# EAGLE design uNav44_r1.2 (EAGLE 6.6.0)
Assembly variants: SWITCHING, LINEAR_3V3, LINEAR FULL

## Sheet 1 of 2
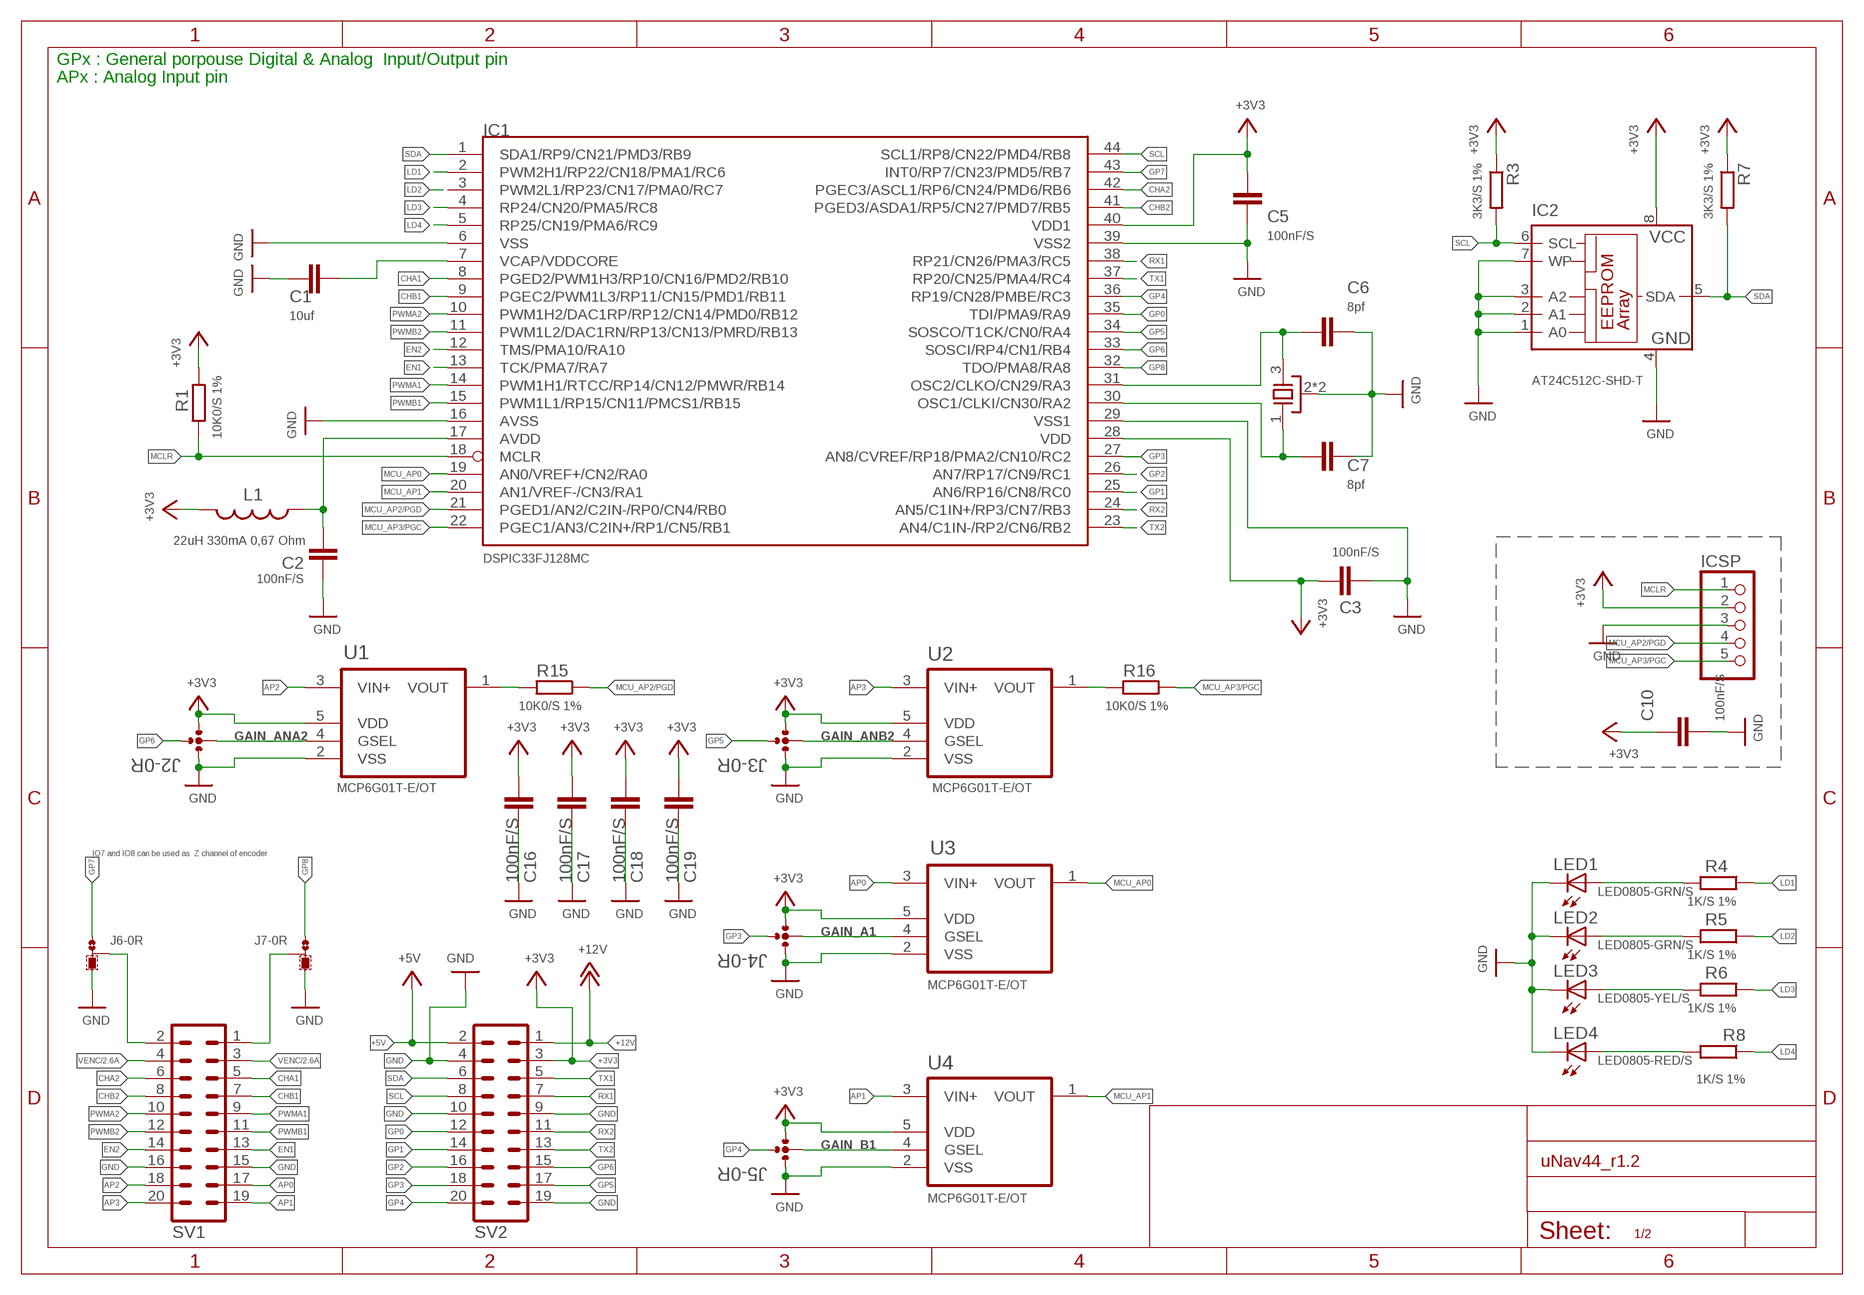
[diagram p0: schematic, sheet 1]

### Parts
C1  10uf  C-EUC1206  [C1206]
C2  100nF/S  C-EUC0603  [C0603]
C3  100nF/S  C-EUC0603  [C0603]
C5  100nF/S  C-EUC0603  [C0603]
C6  8pf  C-EUC0603  [C0603]
C7  8pf  C-EUC0603  [C0603]
C10  100nF/S  C-EUC0603  [C0603]
C16  100nF/S  C-EUC0603  [C0603]
C17  100nF/S  C-EUC0603  [C0603]
C18  100nF/S  C-EUC0603  [C0603]
C19  100nF/S  C-EUC0603  [C0603]
IC1  DSPIC33FJ128MC  DSPIC33FJ128MC804-PT  [TQFP44]
IC2  AT24C512C-SHD-T  24AA01SM  [SO-08M]
ICSP  PINHD-1X05_2.54-S  [1X05-S]
J2  0R-JUMP-4  [C0R-JUMP-4]
J3  0R-JUMP-4  [C0R-JUMP-4]
J4  0R-JUMP-4  [C0R-JUMP-4]
J5  0R-JUMP-4  [C0R-JUMP-4]
J6  0R-JUMPC  [C0R-JMP]
J7  0R-JUMPC  [C0R-JMP]
L1  22uH 330mA 0,67 Ohm  INDUCTOR0805  [0805]
LED1  LED0805-GRN/S  LEDCHIPLED_0805  [CHIPLED_0805]
LED2  LED0805-GRN/S  LEDCHIPLED_0805  [CHIPLED_0805]
LED3  LED0805-YEL/S  LEDCHIPLED_0805  [CHIPLED_0805]
LED4  LED0805-RED/S  LEDCHIPLED_0805  [CHIPLED_0805]
R1  10K0/S 1%  R-EU_R0603  [R0603]
R3  3K3/S 1%  R-EU_R0603  [R0603]
R4  1K/S 1%  R-EU_R0603  [R0603]
R5  1K/S 1%  R-EU_R0603  [R0603]
R6  1K/S 1%  R-EU_R0603  [R0603]
R7  3K3/S 1%  R-EU_R0603  [R0603]
R8  1K/S 1%  R-EU_R0603  [R0603]
R15  10K0/S 1%  R-EU_R0603  [R0603]
R16  10K0/S 1%  R-EU_R0603  [R0603]
SV1  MA10-2  [MA10-2]
SV2  MA10-2  [MA10-2]
U1  MCP6G01T-E/OT  [SOT95P300X145-5N]
U2  MCP6G01T-E/OT  [SOT95P300X145-5N]
U3  MCP6G01T-E/OT  [SOT95P300X145-5N]
U4  MCP6G01T-E/OT  [SOT95P300X145-5N]
XT1  10Mhz 8pf SMD 3,20x2,50  CTS_32X25_SMD  [CTS_32X25]

### Nets
+3V3: C3.1 C5.2 C10.1 C16.1 C17.1 C18.1 C19.1 IC1.28(VDD) IC1.40(VDD1) IC2.8(VCC) ICSP.2 J2.1 J3.1 J4.1 J5.1 L1.2 R1.2 R3.1 R7.1 SV2.3 U1.5(VDD) U2.5(VDD) U3.5(VDD) U4.5(VDD) ; also sheet 2
+5V: SV2.2 ; also sheet 2
+12V: SV2.1 ; also sheet 2
AP0: SV1.17 U3.3(VIN+)
AP1: SV1.19 U4.3(VIN+)
AP2: SV1.18 U1.3(VIN+)
AP3: SV1.20 U2.3(VIN+)
AVDD: C2.2 IC1.17(AVDD) L1.1
CHA1: IC1.8(PGED2/PWM1H3/RP10/CN16/PMD2/RB10) SV1.5
CHA2: IC1.42(PGEC3/ASCL1/RP6/CN24/PMD6/RB6) SV1.6
CHB1: IC1.9(PGEC2/PWM1L3/RP11/CN15/PMD1/RB11) SV1.7
CHB2: IC1.41(PGED3/ASDA1/RP5/CN27/PMD7/RB5) SV1.8
EN1: IC1.13(TCK/PMA7/RA7) SV1.13
EN2: IC1.12(TMS/PMA10/RA10) SV1.14
GAIN_A1: J4.2 U3.4(GSEL)
GAIN_ANA2: J2.2 U1.4(GSEL)
GAIN_ANB2: J3.2 U2.4(GSEL)
GAIN_B1: J5.2 U4.4(GSEL)
GND: C1.2 C2.1 C3.2 C5.1 C6.2 C7.1 C10.2 C16.2 C17.2 C18.2 C19.2 IC1.6(VSS) IC1.16(AVSS) IC1.29(VSS1) IC1.39(VSS2) IC2.1(A0) IC2.2(A1) IC2.3(A2) IC2.4(GND) IC2.7(WP) ICSP.3 J2.3 J3.3 J4.3 J5.3 J6.3 J7.3 LED1.C LED2.C LED3.C LED4.C SV1.15 SV1.16 SV2.4 SV2.9 SV2.10 SV2.19 U1.2(VSS) U2.2(VSS) U3.2(VSS) U4.2(VSS) XT1.2(GND) XT1.4(GND) ; also sheet 2
GP0: IC1.35(TDI/PMA9/RA9) SV2.12
GP1: IC1.25(AN6/RP16/CN8/RC0) SV2.14
GP2: IC1.26(AN7/RP17/CN9/RC1) SV2.16
GP3: IC1.27(AN8/CVREF/RP18/PMA2/CN10/RC2) J4.4 SV2.18
GP4: IC1.36(RP19/CN28/PMBE/RC3) J5.4 SV2.20
GP5: IC1.34(SOSCO/T1CK/CN0/RA4) J3.4 SV2.17
GP6: IC1.33(SOSCI/RP4/CN1/RB4) J2.4 SV2.15
GP7: IC1.43(INT0/RP7/CN23/PMD5/RB7) J6.1
GP8: IC1.32(TDO/PMA8/RA8) J7.1
LD1: IC1.2(PWM2H1/RP22/CN18/PMA1/RC6) R4.1
LD2: IC1.3(PWM2L1/RP23/CN17/PMA0/RC7) R5.1
LD3: IC1.4(RP24/CN20/PMA5/RC8) R6.1
LD4: IC1.5(RP25/CN19/PMA6/RC9) R8.1
MCLR: IC1.18(MCLR) ICSP.1 R1.1
MCU_AP0: IC1.19(AN0/VREF+/CN2/RA0) U3.1(VOUT)
MCU_AP1: IC1.20(AN1/VREF-/CN3/RA1) U4.1(VOUT)
MCU_AP2/PGD: IC1.21(PGED1/AN2/C2IN-/RP0/CN4/RB0) ICSP.4 R15.1
MCU_AP3/PGC: IC1.22(PGEC1/AN3/C2IN+/RP1/CN5/RB1) ICSP.5 R16.1
N$2: C7.2 IC1.30(OSC1/CLKI/CN30/RA2) XT1.1(X1)
N$3: C6.1 IC1.31(OSC2/CLKO/CN29/RA3) XT1.3(X2)
N$10: J6.2 SV1.2
N$12: LED1.A R4.2
N$13: LED2.A R5.2
N$21: R15.2 U1.1(VOUT)
N$22: R16.2 U2.1(VOUT)
N$23: J7.2 SV1.1
PWMA1: IC1.14(PWM1H1/RTCC/RP14/CN12/PMWR/RB14) SV1.9
PWMA2: IC1.10(PWM1H2/DAC1RP/RP12/CN14/PMD0/RB12) SV1.10
PWMB1: IC1.15(PWM1L1/RP15/CN11/PMCS1/RB15) SV1.11
PWMB2: IC1.11(PWM1L2/DAC1RN/RP13/CN13/PMRD/RB13) SV1.12
RX1: IC1.38(RP21/CN26/PMA3/RC5) SV2.7
RX2: IC1.24(AN5/C1IN+/RP3/CN7/RB3) SV2.11
SCL: IC1.44(SCL1/RP8/CN22/PMD4/RB8) IC2.6(SCL) R3.2 SV2.8
SDA: IC1.1(SDA1/RP9/CN21/PMD3/RB9) IC2.5(SDA) R7.2 SV2.6
TX1: IC1.37(RP20/CN25/PMA4/RC4) SV2.5
TX2: IC1.23(AN4/C1IN-/RP2/CN6/RB2) SV2.13
VCAP/VDDCORE: C1.1 IC1.7(VCAP/VDDCORE)
VENC: SV1.3 SV1.4 ; also sheet 2
VENC1-LD3: LED3.A R6.2
VENC2-LD4: LED4.A R8.2

### Notes on the sheet
- GPx : General porpouse Digital & Analog  Input/Output pin
- APx : Analog Input pin
- IO7 and IO8 can be used as  Z channel of encoder

## Sheet 2 of 2
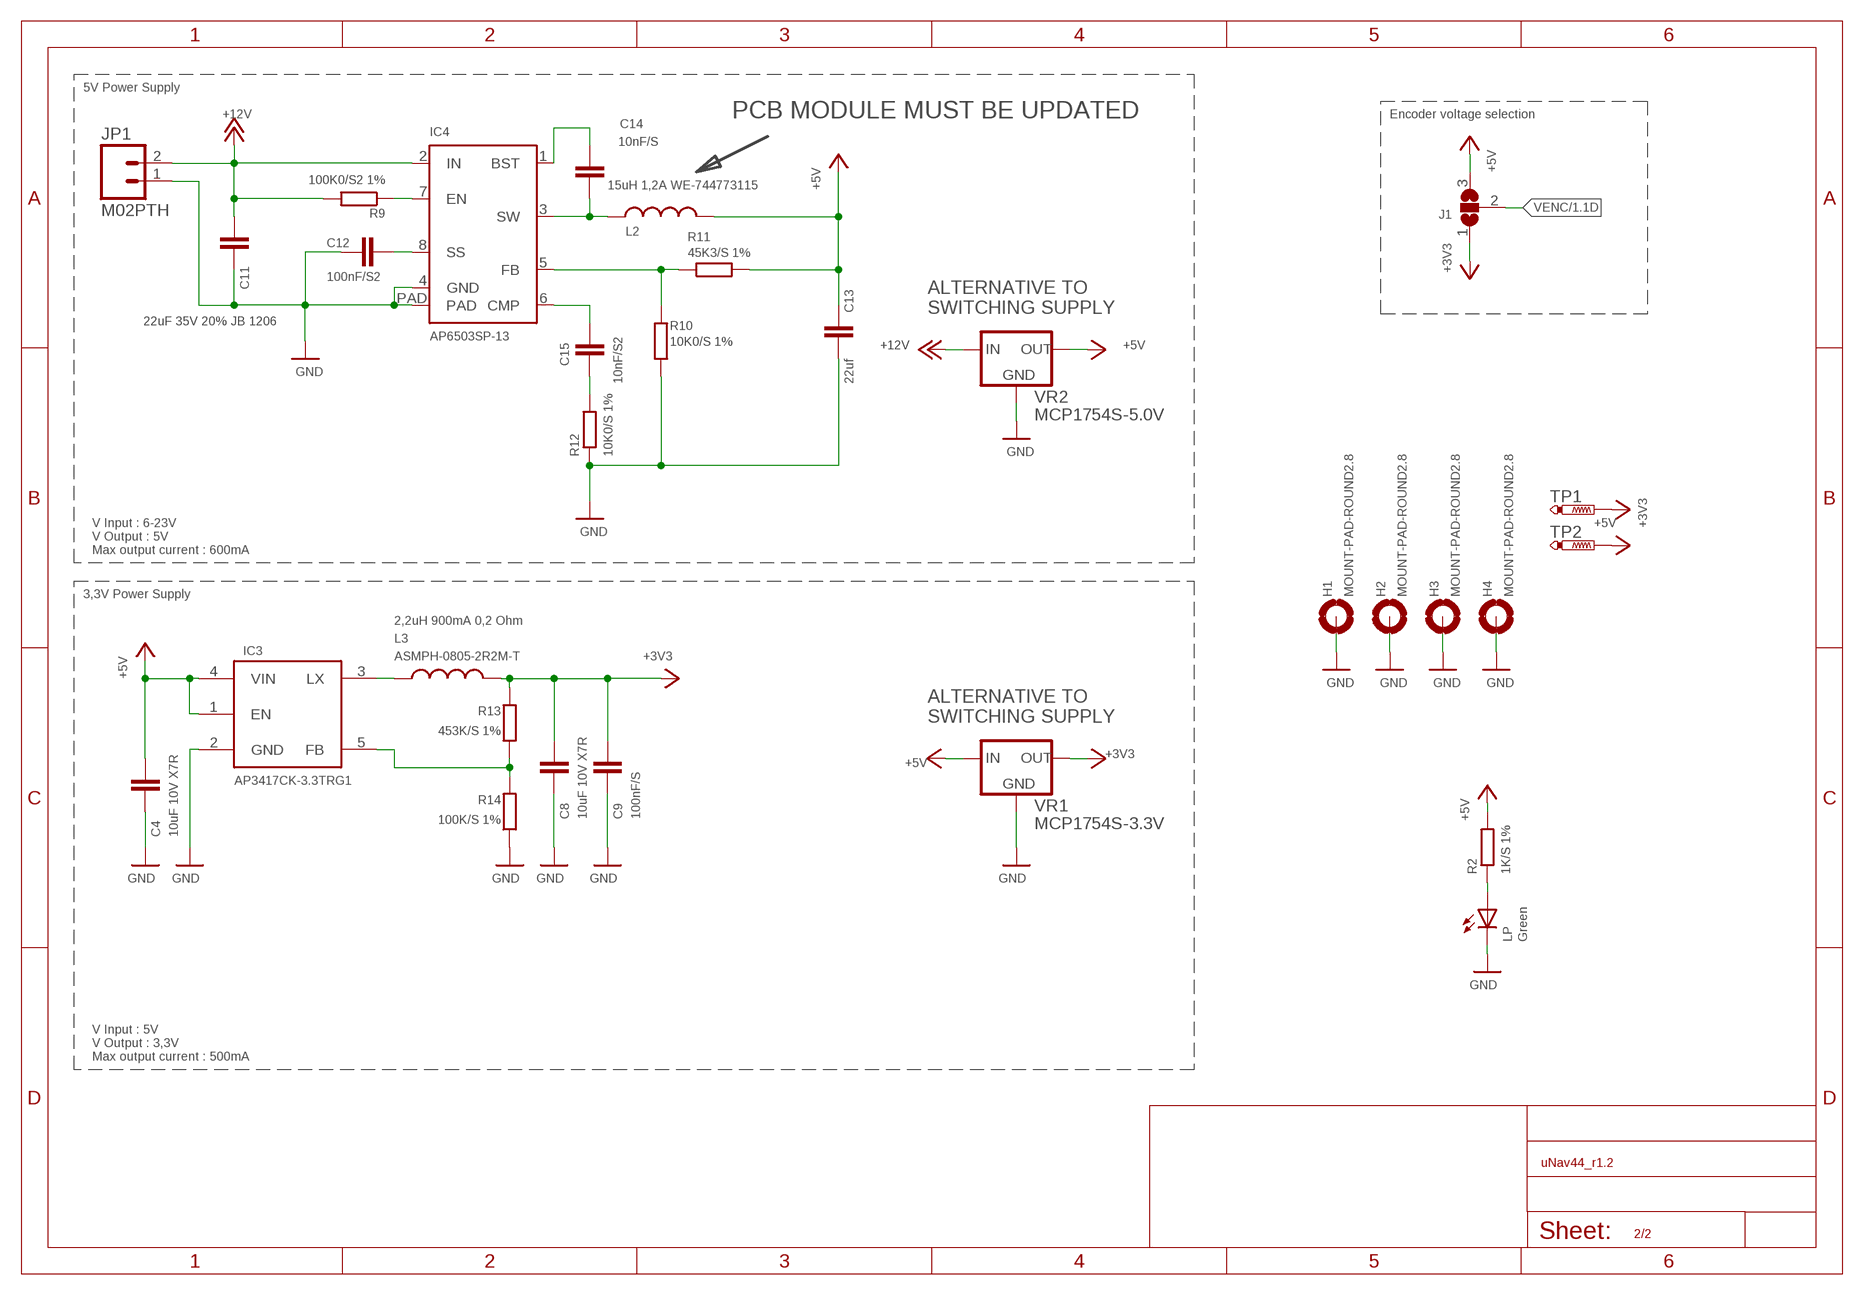
[diagram p1: schematic, sheet 2]

### Parts
C4  10uF 10V X7R  C-EUC0805  [C0805]
C8  10uF 10V X7R  C-EUC0805  [C0805]
C9  100nF/S  C-EUC0603  [C0603]
C11  22uF 35V 20% JB 1206  C-EUC1206  [C1206]
C12  100nF/S2  C-EUC0603  [C0603]  (not fitted in variant LINEAR FULL)
C13  22uf  C-EUC1206  [C1206]
C14  10nF/S  C-EUC0603  [C0603]  (not fitted in variant LINEAR FULL)
C15  10nF/S2  C-EUC0603  [C0603]  (not fitted in variant LINEAR FULL)
H1  MOUNT-PAD-ROUND2.8  [2,8-PAD]
H2  MOUNT-PAD-ROUND2.8  [2,8-PAD]
H3  MOUNT-PAD-ROUND2.8  [2,8-PAD]
H4  MOUNT-PAD-ROUND2.8  [2,8-PAD]
IC3  AP3417CK-3.3TRG1  AP3417CSOT-23-5  [SOT-23-5]  (not fitted in variant LINEAR_3V3)  (not fitted in variant LINEAR FULL)
IC4  AP6503SP-13  AP6503SP-13'SO-8EP'  [SO-8EP]  (not fitted in variant LINEAR FULL)
J1  SJ2W  [SJ_2]
JP1  M02PTH  [1X02]  (not fitted in variant SWITCHING)
L2  15uH 1,2A WE-744773115  INDUCTOR1210  [1210]  (not fitted in variant LINEAR FULL)
L3  ASMPH-0805-2R2M-T  INDUCTOR0805  [0805]  (not fitted in variant LINEAR_3V3)  (not fitted in variant LINEAR FULL)
LP  Green  LEDCHIPLED_0805  [CHIPLED_0805]
R2  1K/S 1%  R-EU_R0603  [R0603]
R9  100K0/S2 1%  R-EU_R0603  [R0603]  (not fitted in variant LINEAR FULL)
R10  10K0/S 1%  R-EU_R0603  [R0603]  (not fitted in variant LINEAR FULL)
R11  45K3/S 1%  R-EU_R0603  [R0603]  (not fitted in variant LINEAR FULL)
R12  10K0/S 1%  R-EU_R0603  [R0603]  (not fitted in variant LINEAR FULL)
R13  453K/S 1%  R-EU_R0603  [R0603]  (not fitted in variant LINEAR_3V3)  (not fitted in variant LINEAR FULL)
R14  100K/S 1%  R-EU_R0603  [R0603]  (not fitted in variant LINEAR_3V3)  (not fitted in variant LINEAR FULL)
TP1  PTR1TP07R  [TP07R]
TP2  PTR1TP07R  [TP07R]
VR1  MCP1754S-3.3V  MCP1754S  [SOT89]  (not fitted in variant SWITCHING)
VR2  MCP1754S-5.0V  MCP1754S  [SOT89]  (not fitted in variant SWITCHING)  (not fitted in variant LINEAR_3V3)  (not fitted in variant LINEAR FULL)

### Nets
+3V3: C8.1 C9.1 J1.1 L3.2 R13.2 TP1.TP VR1.3(OUT) ; also sheet 1
+5V: C4.1 C13.1 IC3.1(EN) IC3.4(VIN) J1.3 L2.2 R2.2 R11.2 TP2.TP VR1.1(IN) VR2.3(OUT) ; also sheet 1
+12V: C11.1 IC4.2(IN) JP1.2 R9.2 VR2.1(IN) ; also sheet 1
GND: C4.2 C8.2 C9.2 C11.2 C12.2 C13.2 H1.B2,8(MOUNT) H2.B2,8(MOUNT) H3.B2,8(MOUNT) H4.B2,8(MOUNT) IC3.2(GND) IC4.4(GND) IC4.PAD JP1.1 LP.C R10.2 R12.1 R14.1 VR1.2(GND) VR1.4(GND) VR2.2(GND) VR2.4(GND) ; also sheet 1
N$1: IC3.3(LX) L3.1
N$4: C14.1 IC4.1(BST)
N$5: LP.A R2.1
N$6: IC4.7(EN) R9.1
N$7: IC3.5(FB) R13.1 R14.2
N$8: C12.1 IC4.8(SS)
N$9: IC4.5(FB) R10.1 R11.1
N$15: C14.2 IC4.3(SW) L2.1
N$16: C15.1 IC4.6(CMP)
N$17: C15.2 R12.2
VENC: J1.2 ; also sheet 1

### Notes on the sheet
- 5V Power Supply
- PCB MODULE MUST BE UPDATED | Encoder voltage selection
- ALTERNATIVE TO
  SWITCHING SUPPLY
- V Input : 6-23V
  V Output : 5V
  Max output current : 600mA
- 3,3V Power Supply
- 2,2uH 900mA 0,2 Ohm
- ALTERNATIVE TO
  SWITCHING SUPPLY
- V Input : 5V
  V Output : 3,3V
  Max output current : 500mA

## Library data of the parts
C1-C19 = rcl:C-EU: CAPACITOR, European symbol
H1-H4 = holes:MOUNT-PAD-ROUND: MOUNTING PAD, round
IC1 = microchip-dspic33fjxxmc:DSPIC33FJ128MC804: dsPIC33FJ32MC302/304, dsPIC33FJ64MCX02/X04, AND dsPIC33FJ128MCX02/X04 High-Performance, 16-bit Digital Signal Controllers Package:44 Pin TQFP Operating Range: * Up to 40 MIPS operation (at 3.0V -3.6V): - Industrial temperature range (-40°C to +85°C) - Extended temperature range (-40°C to +125°C) High-Performance DSC CPU: * Modified Harvard architecture * C compiler optimized instruction set * 16-bit wide data path * 24-bit wide instructions * Linear program memory addressing up to 4M instruction words * Linear data memory addressing up to 64 Kbytes * 83 base instructions: mostly 1 word/1 cycle * Two 40-bit accumulators with rounding and saturation options * Flexible and powerful addressing modes: - Indirect - Modulo - Bit-Reversed * Software stack * 16 x 16 fractional/integer multiply operations * 32/16 and 16/16 divide operations * Single-cycle multiply and accumulate: - Accumulator write back for DSP operations - Dual data fetch * Up to ±16-bit shifts for up to 40-bit data Direct Memory Access (DMA): * 8-channel hardware DMA * Up to 2 Kbytes dual ported DMA buffer area (DMA RAM) to store data transferred via DMA: - Allows data transfer between RAM and a peripheral while CPU is executing code (no cycle stealing) * Most peripherals support DMA Timers/Capture/Compare/PWM: * Timer/Counters, up to five 16-bit timers: - Can pair up to make two 32-bit timers - One timer runs as a Real-Time Clock with an external 32.768 kHz oscillator - Programmable prescaler * Input Capture (up to four channels): - Capture on up, down or both edges - 16-bit capture input functions - 4-deep FIFO on each capture * Output Compare (up to four channels): - Single or Dual 16-bit Compare mode - 16-bit Glitchless PWM mode * Hardware Real-Time Clock/Calendar (RTCC): - Provides clock, calendar, and alarm functions Interrupt Controller: * 5-cycle latency * Up to 53 available interrupt sources * Up to three external interrupts * Seven programmable priority levels * Five processor exceptions Digital I/O: * Peripheral pin Select functionality * Up to 35 programmable digital I/O pins * Wake-up/Interrupt-on-Change for up to 31 pins * Output pins can drive from 3.0V to 3.6V * Up to 5V output with open drain configuration * All digital input pins are 5V tolerant * 4 mA sink on all I/O pins On-Chip Flash and SRAM: * Flash program memory (up to 128 Kbytes) * Data SRAM (up to 16 Kbytes) * Boot, Secure, and General Security for program Flash System Management: * Flexible clock options: - External, crystal, resonator, internal RC - Fully integrated Phase-Locked Loop (PLL) - Extremely low jitter PLL * Power-up Timer * Oscillator Start-up Timer/Stabilizer * Watchdog Timer with its own RC oscillator * Fail-Safe Clock Monitor * Reset by multiple sources Power Management: * On-chip 2.5V voltage regulator * Switch between clock sources in real time * Idle, Sleep, and Doze modes with fast wake-up Analog-to-Digital Converters (ADCs): * 10-bit, 1.1 Msps or 12-bit, 500 Ksps conversion: - Two and four simultaneous samples (10-bit ADC) - Up to nine input channels with auto-scanning - Conversion start can be manual or synchronized with one of four trigger sources - Conversion possible in Sleep mode - ±2 LSb max integral nonlinearity - ±1 LSb max differential nonlinearity Audio Digital-to-Analog Converter (DAC): - 16-bit Dual Channel DAC module - 100 Ksps maximum sampling rate - Second-Order Digital Delta-Sigma Modulator Comparator Module: * Two analog comparators with programmable input/output configuration CMOS Flash Technology: * Low-power, high-speed Flash technology * Fully static design * 3.3V (±10%) operating voltage * Industrial and Extended temperature * Low power consumption Motor Control Peripherals: * 6-channel 16-bit Motor Control PWM: - Three duty cycle generators - Independent or Complementary mode - Programmable dead-time and output polarity - Edge-aligned or center-aligned - Manual output override control - One Fault input - Trigger for ADC conversions - PWM frequency for 16-bit resolution (@ 40 MIPS) = 1220 Hz for Edge-Aligned mode, 610 Hz for Center-Aligned mode - PWM frequency for 11-bit resolution (@ 40 MIPS) = 39.1 kHz for Edge-Aligned mode, 19.55 kHz for Center-Aligned mode * 2-channel 16-bit Motor Control PWM: - One duty cycle generator - Independent or Complementary mode - Programmable dead time and output polarity - Edge-aligned or center-aligned - Manual output override control - One Fault input - Trigger for ADC conversions - PWM frequency for 16-bit resolution (@ 40 MIPS) = 1220 Hz for Edge-Aligned mode, 610 Hz for Center-Aligned mode - PWM frequency for 11-bit resolution (@ 40 MIPS) = 39.1 kHz for Edge-Aligned mode, 19.55 kHz for Center-Aligned mode * 2-Quadrature Encoder Interface module: - Phase A, Phase B, and index pulse input - 16-bit up/down position counter - Count direction status - Position Measurement (x2 and x4) mode - Programmable digital noise filters on inputs - Alternate 16-bit Timer/Counter mode - Interrupt on position counter rollover/underflow
IC2 = microchip:24*: Serial EEPROM I2C
IC3 = OfficineRobotiche:AP3417C
IC4 = OfficineRobotiche:AP6503SP-13: 340kHz 23V 3A SYNCHRONOUS DC/DC BUCK CONVERTER
ICSP = pinhead-2:PINHD-1X05: PIN HEADER
J1 = jumper:SJ2W: SMD solder JUMPER
J2-J5 = OfficineRobotiche:0R-JUMP-4
J6 J7 = jump-0r-smd:0R-JUMP: SMD 0R 0805 Jumper
JP1 = SparkFun-Connectors:M02: Standard 2-pin 0.1" header. Use with - straight break away headers ( PRT-00116) - right angle break away headers (PRT-00553) - swiss pins (PRT-00743) - machine pins (PRT-00117) - female headers (PRT-00115) Molex polarized connector foot print use with: PRT-08233 with associated crimp pins and housings. 2.54_SCREWTERM for use with PRT-10571. 3.5mm Screw Terminal footprints for PRT-08084 5mm Screw Terminal footprints for use with PRT-08433
L1-L3 = SparkFun-Passives:INDUCTOR: Inductors Basic Inductor/Choke - 0603 and 1206. Footprints are not proven and vary greatly between part numbers. SRN6045- 33uH, 20% 1.4A SDR0403-560KL - 56uH, 10%, 500mA RMS/740mA peak
LED1-LED4 LP = led:LED: LED OSRAM: - CHIPLED LG R971, LG N971, LY N971, LG Q971, LY Q971, LO R971, LY R971 LH N974, LH R974 LS Q976, LO Q976, LY Q976 LO Q996 - Hyper CHIPLED LW Q18S LB Q993, LB Q99A, LB R99A - SideLED LS A670, LO A670, LY A670, LG A670, LP A670 LB A673, LV A673, LT A673, LW A673 LH A674 LY A675 LS A676, LA A676, LO A676, LY A676, LW A676 LS A679, LY A679, LG A679 - Hyper Micro SIDELED® LS Y876, LA Y876, LO Y876, LY Y876 LT Y87S - SmartLED LW L88C, LW L88S LB L89C, LB L89S, LG L890 LS L89K, LO L89K, LY L89K LS L896, LA L896, LO L896, LY L896 - TOPLED LS T670, LO T670, LY T670, LG T670, LP T670 LSG T670, LSP T670, LSY T670, LOP T670, LYG T670 LG T671, LOG T671, LSG T671 LB T673, LV T673, LT T673, LW T673 LH T674 LS T676, LA T676, LO T676, LY T676, LB T676, LH T676, LSB T676, LW T676 LB T67C, LV T67C, LT T67C, LS T67K, LO T67K, LY T67K, LW E67C LS E67B, LA E67B, LO E67B, LY E67B, LB E67C, LV E67C, LT E67C LW T67C LS T679, LY T679, LG T679 LS T770, LO T770, LY T770, LG T770, LP T770 LB T773, LV T773, LT T773, LW T773 LH T774 LS E675, LA E675, LY E675, LS T675 LS T776, LA T776, LO T776, LY T776, LB T776 LHGB T686 LT T68C, LB T68C - Hyper Mini TOPLED® LB M676 - Mini TOPLED Santana® LG M470 LS M47K, LO M47K, LY M47K Source: http://www.osram.convergy.de LUXEON: - LUMILED® LXK2-PW12-R00, LXK2-PW12-S00, LXK2-PW14-U00, LXK2-PW14-V00 LXK2-PM12-R00, LXK2-PM12-S00, LXK2-PM14-U00 LXK2-PE12-Q00, LXK2-PE12-R00, LXK2-PE12-S00, LXK2-PE14-T00, LXK2-PE14-U00 LXK2-PB12-K00, LXK2-PB12-L00, LXK2-PB12-M00, LXK2-PB14-N00, LXK2-PB14-P00, LXK2-PB14-Q00 LXK2-PR12-L00, LXK2-PR12-M00, LXK2-PR14-Q00, LXK2-PR14-R00 LXK2-PD12-Q00, LXK2-PD12-R00, LXK2-PD12-S00 LXK2-PH12-R00, LXK2-PH12-S00 LXK2-PL12-P00, LXK2-PL12-Q00, LXK2-PL12-R00 Source: www.luxeon.com KINGBRIGHT: KA-3528ASYC Source: www.kingbright.com
R1-R16 = rcl:R-EU_: RESISTOR, European symbol
SV1 SV2 = OfficineRobotiche:MA10-2: PIN HEADER; OC_FARNELL: unknown; OC_NEWARK: unknown
TP1 TP2 = testpad:PTR1: TEST PIN
U1-U4 = OfficineRobotiche:MCP6G01T-E/OT: AMP, SELECT GAIN SINGLE 1 MHZ; MPN: MCP6G01T-E/OT; OC_FARNELL: 1332148; OC_NEWARK: 34M7463; PACKAGE: SOT23-5; SUPPLIER: Microchip
VR1 VR2 = Personale:MCP1754S
XT1 = OfficineRobotiche:CTS_32X25_SMD: http://www.txccrystal.com/images/pdf/7v.pdf http://www.digikey.it/product-detail/it/7V-10.000MAAV-T/887-1791-1-ND/3586039

## Net classes
0 default: width 0.254 mm, drill 0.305 mm, clearance 0.203 mm
1 power: width 0.254 mm, drill 0.305 mm, clearance 0.203 mm

## Board
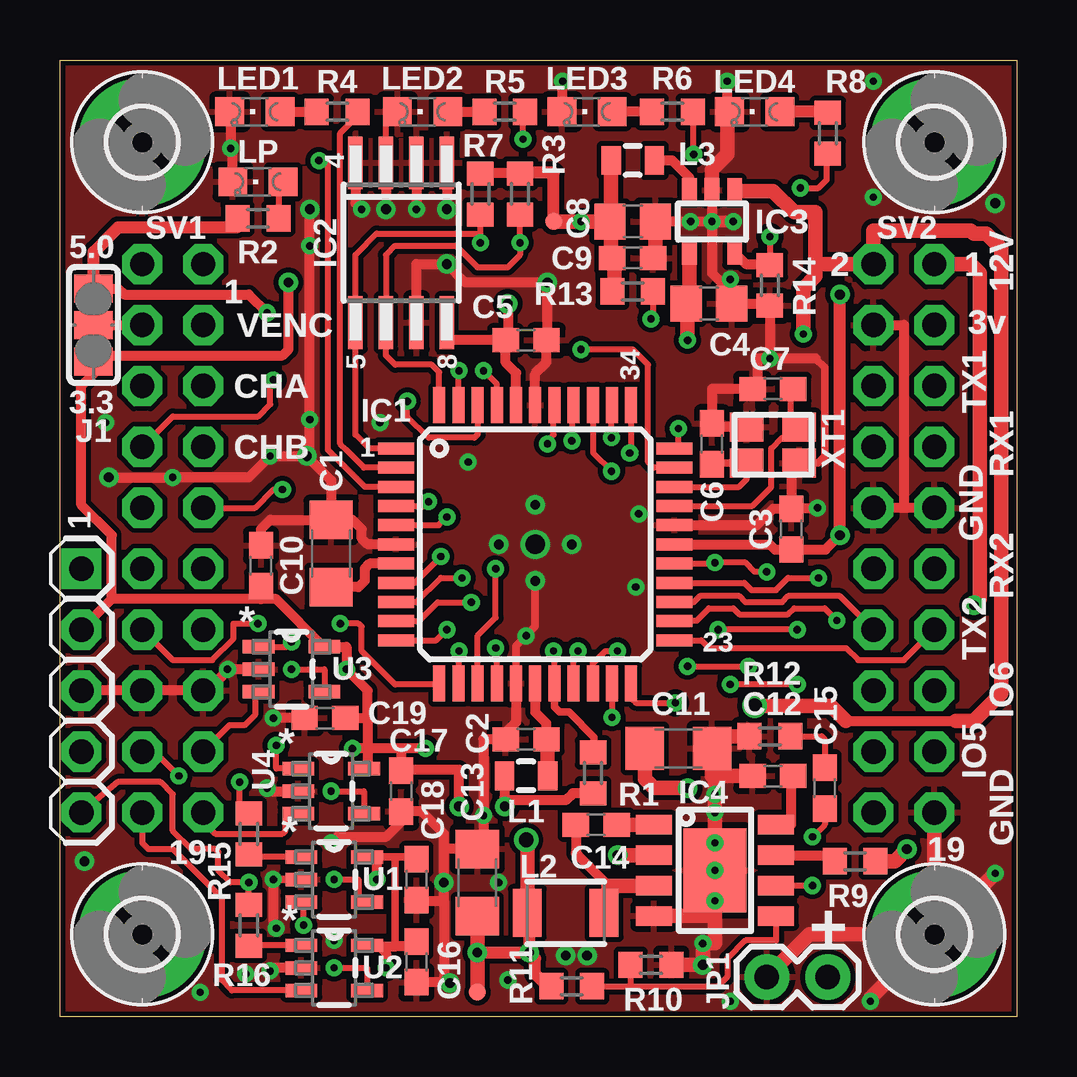
[diagram p2: board, top side]
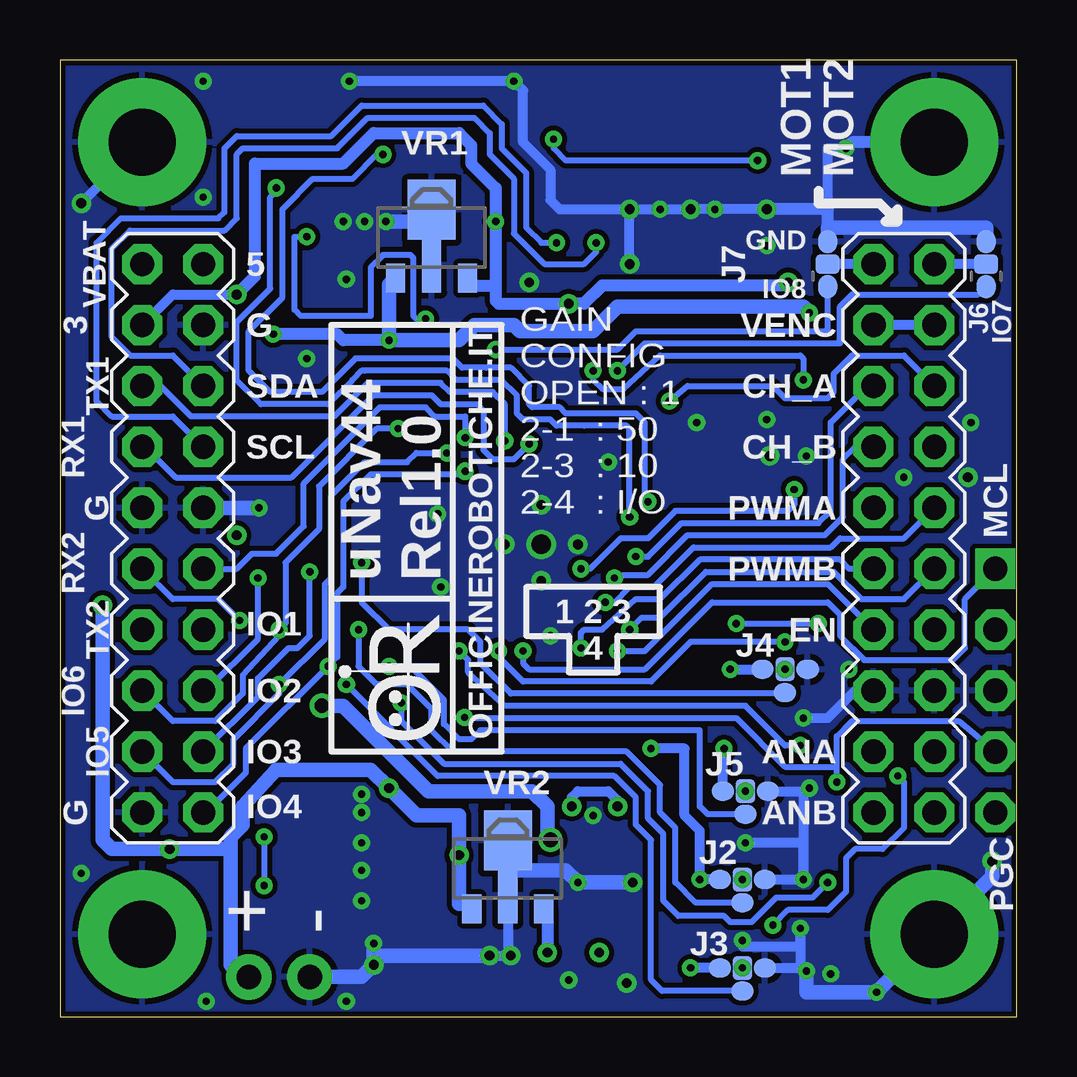
[diagram p3: board, bottom side, seen from below]

Size 39.88 x 39.88 mm. Coordinates in mm from the lower left corner, seen from the top.
Outline: 39.88,0 0,0 0,39.88 39.88,39.88 39.88,0
Copper layers (1*16): Top 0.035mm / dielectric 1.5mm / Bottom 0.035mm
Design rules "uNav44 *": minimum track width 8mil, minimum drill 12mil, track to track 8mil, track to pad 8mil, pad to pad 8mil, via to via 8mil, smd to smd 8mil, copper to edge 8mil, drill to drill 8mil, minimum pad ring 13mil, minimum via ring 8mil, stop-mask expansion 4mil, vias tented up to drill 24mil, thermal gap 10mil

### Footprints (pad centres in the part's own frame; a part is rotated, then mirrored left to right if it is on the bottom)
C1206 = smd 1.6 x 1.8: 1 -1.4,0; 2 1.4,0
C0603 = smd 1.1 x 1: 1 -0.85,0; 2 0.85,0
C0805 = smd 1.3 x 1.5: 1 -0.95,0; 2 0.95,0
2,8-PAD = drill 2.8 pad 5.334: B2,8 0,0
TQFP44 = smd 1.5 x 0.5: 1 -5.8,4; 2 -5.8,3.2; 3 -5.8,2.4; 4 -5.8,1.6; 5 -5.8,0.8; 6 -5.8,0; 7 -5.8,-0.8; 8 -5.8,-1.6; 9 -5.8,-2.4; 10 -5.8,-3.2; 11 -5.8,-4; 23 5.8,-4; 24 5.8,-3.2; 25 5.8,-2.4; 26 5.8,-1.6; 27 5.8,-0.8; 28 5.8,0; 29 5.8,0.8; 30 5.8,1.6; 31 5.8,2.4; 32 5.8,3.2; 33 5.8,4 | smd 0.5 x 1.5: 12 -4,-5.8; 13 -3.2,-5.8; 14 -2.4,-5.8; 15 -1.6,-5.8; 16 -0.8,-5.8; 17 0,-5.8; 18 0.8,-5.8; 19 1.6,-5.8; 20 2.4,-5.8; 21 3.2,-5.8; 22 4,-5.8; 34 4,5.8; 35 3.2,5.8; 36 2.4,5.8; 37 1.6,5.8; 38 0.8,5.8; 39 0,5.8; 40 -0.8,5.8; 41 -1.6,5.8; 42 -2.4,5.8; 43 -3.2,5.8; 44 -4,5.8
SO-08M = smd 0.6 x 2.2: 1 -1.905,-3.33; 2 -0.635,-3.33; 3 0.635,-3.33; 4 1.905,-3.33; 5 1.905,3.33; 6 0.635,3.33; 7 -0.635,3.33; 8 -1.905,3.33
SOT-23-5 = smd 0.61 x 0.991: 1 -0.94,-1.308; 2 0,-1.308; 3 0.94,-1.308; 4 0.94,1.308; 5 -0.94,1.308
SO-8EP = smd 0.802 x 1.505: 1 -1.905,-2.54; 2 -0.635,-2.54; 3 0.635,-2.54; 4 1.905,-2.54; 5 1.905,2.54; 6 0.635,2.54; 7 -0.635,2.54; 8 -1.905,2.54 | smd 3.501 x 2.613: PAD 0,0
1X05-S = drill 1.016 square: 1 -5.08,0 | drill 1.016 octagon: 2 -2.54,0; 3 0,0; 4 2.54,0; 5 5.08,0
SJ_2 = smd 1.168 x 1.6: 1 -1.524,0; 2 0,0; 3 1.524,0
C0R-JUMP-4 = smd 0.8 x 0.95: 1 0,0.94; 3 0,-0.94; 4 -0.965,0 | smd 1 x 0.8: 2 0,0
C0R-JMP = smd 0.8 x 1: 1 0,0.938; 3 0,-0.938 | smd 1 x 0.8: 2 0,0
1X02 = drill 1.016 pad 1.88: 1 0,0; 2 2.54,0
0805 = smd 0.8 x 1.2: 1 -0.9,0; 2 0.9,0
1210 = smd 1.2 x 2: 1 -1.6,0; 2 1.6,0
CHIPLED_0805 = smd 1.2 x 1.2: A 0,-1.05; C 0,1.05
R0603 = smd 1 x 1.1: 1 -0.85,0; 2 0.85,0
MA10-2 = drill 1.016 octagon: 1 -11.43,-1.27; 2 -11.43,1.27; 3 -8.89,-1.27; 4 -8.89,1.27; 5 -6.35,-1.27; 6 -6.35,1.27; 7 -3.81,-1.27; 8 -3.81,1.27; 9 -1.27,-1.27; 10 -1.27,1.27; 11 1.27,-1.27; 12 1.27,1.27; 13 3.81,-1.27; 14 3.81,1.27; 15 6.35,-1.27; 16 6.35,1.27; 17 8.89,-1.27; 18 8.89,1.27; 19 11.43,-1.27; 20 11.43,1.27
TP07R = smd 0.7 x 0.7: TP 0,0
SOT95P300X145-5N = smd 1.321 x 0.559: 1 -1.372,0.94; 2 -1.372,0; 3 -1.372,-0.94; 4 1.372,-0.94; 5 1.372,0.94
SOT89 = smd 0.8 x 1.2: 1 -1.5,-1.6; 3 1.5,-1.6 | smd 0.8 x 2.3: 2 0,-1.05 | smd 2 x 2.5: 4 0,1.25
CTS_32X25 = smd 1.4 x 1.2: 1 -1.1,-0.7; 2 1.1,-0.7; 3 1.1,0.8; 4 -1.1,0.8

### Placement (x,y rotation side)
C1  11.3,19.3 90 top
C2  19.43,11.56 0 top
C3  30.48,20.32 90 top
C4  27.05,29.72 0 top
C5  19.43,28.19 180 top
C6  27.18,23.88 90 top
C7  29.72,26.16 0 top
C8  23.88,33.15 0 top
C9  23.88,31.62 0 top
C10  8.38,18.8 90 top
C11  25.78,11.18 0 top
C12  29.72,10.03 180 top
C13  17.4,5.59 90 top
C14  22.35,8 180 top
C15  31.88,9.53 90 top
C16  14.86,2.29 270 top
C17  14.22,9.4 270 top
C18  14.86,5.71 270 top
C19  11.05,12.45 180 top
H1  3.43,3.43 0 top
H2  36.45,3.43 0 top
H3  36.45,36.45 0 top
H4  3.43,36.45 0 top
IC1  19.81,19.68 0 top
IC2  14.22,32.26 180 top
IC3  27.18,33.15 180 top
IC4  27.3,6.1 270 top
ICSP  0.89,13.59 270 top
J1  1.4,28.83 90 top
J2  11.43,5.71 90 bottom
J3  11.43,2.03 90 bottom
J4  9.65,14.48 90 bottom
J5  11.3,9.4 90 bottom
J6  1.27,31.37 180 bottom
J7  7.87,31.37 180 bottom
JP1  29.46,1.65 0 top
L1  19.43,10.03 180 top
L2  21.08,4.32 180 top
L3  23.88,35.69 180 top
LED1  8.13,37.72 90 top
LED2  15.11,37.72 90 top
LED3  21.97,37.72 90 top
LED4  28.96,37.72 90 top
LP  8.25,34.8 90 top
R1  22.22,10.16 270 top
R2  8.25,33.27 180 top
R3  19.18,34.29 270 top
R4  11.56,37.72 180 top
R5  18.54,37.72 180 top
R6  25.53,37.72 180 top
R7  17.53,34.29 270 top
R8  32,36.83 90 top
R9  33.15,6.48 0 top
R10  24.64,2.16 0 top
R11  21.34,1.27 180 top
R12  29.59,11.68 0 top
R13  23.88,30.23 180 top
R14  29.59,30.48 90 top
R15  7.87,7.62 270 top
R16  7.87,3.81 270 top
SV1  4.7,19.94 270 bottom
SV2  35.18,19.94 270 bottom
TP1  20.57,33.15 0 top
TP2  17.4,1.02 0 top
U1  11.43,5.71 0 top
U2  11.43,2.03 0 top
U3  9.65,14.48 0 top
U4  11.3,9.4 0 top
VR1  24.38,32.38 0 bottom
VR2  21.21,6.1 0 bottom
XT1  29.72,23.88 180 top

### Tracks (layer width: path | path; a pad name or v marks a point on that pad's centre or on a via)
+3V3  (via drill 0.3, 0.41)
  Top 0.254: R7.1 17.56,35.18 | U2.5 12.89,2.88 12.95,2.92 | 14.86,2.92 C16.1
  Top 0.305: C18.1 14.9,6.65 13.97,6.65 | 13.97,6.65 U1.5 | 13.97,2.92 13.97,6.65
  Top 0.406: IC1.40 19.01,26.83 18.58,27.27 C5.2 | IC1.28 29.59,19.68 29.81,19.47 C3.1 31.92,19.47 v32.51,20.07 | C5.2 16.13,28.19 IC2.8 | R7.1 17.4,35.18 17.56,35.18 19.05,35.18 R3.1 | v18.67,29.72 18.67,28.19 C5.2 | L3.2 22.98,33.15 C8.1 | U2.5 13.28,2.97 13.59,2.67 v13.59,2.03 | U4.5 12.83,10.34 12.83,11.18 | 12.83,11.18 v12.19,11.18 | U1.5 13.21,6.65 v13.21,5.71 13.21,5.64 | 8.38,17.4 9.02,17.4 11,15.42 U3.5 11.94,15.42 v11.94,14.48 12.83,13.59 12.83,12.45 | R1.2 21.38,9.31 21.08,9.02 18.54,9.02 v18.54,8.76 18.53,9.13 L1.2 18.54,10.03 L1.2 | v16.64,8.76 16.64,10.29 14.26,10.29 C17.1 14.22,11.18 v15.24,11.18 12.83,11.18 | C19.1 12.83,12.45 | 12.83,12.45 12.83,11.18 | C10.1 8.38,17.4 | v9.53,30.61 9.53,27.81 9.27,27.56 1.52,27.56 1.4,27.43 J1.1 1.4,26.8 0.89,26.29 0.89,21.34 2.16,20.07 2.16,17.4 | 8.38,17.4 2.16,17.4 | 2.16,17.4 ICSP.2 | 14.86,2.92 13.97,2.92 12.95,2.92
  Top 0.508: TP1.TP 20.57,35.18 19.05,35.18 | 22.99,33.15 v21.72,33.15 | v32.51,20.07 v32.51,30.1
  Top 0.61: TP1.TP v21.72,33.15 C8.1 | R13.2 23.11,30.31 23.11,31.5 23.03,31.58 C9.1 22.98,31.67 22.98,33.15 | L3.2 22.98,33.16 22.99,33.15
  Bottom 0.406: SV2.3 35.18,30.1 v32.51,30.1 | v11.94,14.48 J4.1 | v18.54,8.76 18.54,9.14 18.29,9.4 17.02,9.4 16.64,9.02 v16.64,8.76 | J5.1 12.24,10.92 v12.19,11.18 | J2.1 v13.21,5.71 13.21,7.75 13.84,8.38 13.84,11.18 v15.24,11.18 | J3.1 v13.59,2.03
  Bottom 0.508: 21.72,30.48 v21.72,33.15 21.72,34.54 22.73,35.56 22.73,36.32 23.24,36.83 26.8,36.83 28.07,35.56 31.75,35.56 31.75,30.86 v32.51,30.1 | 21.72,30.48 21.72,29.84 21.59,29.72 v18.67,29.72 18.03,29.72 17.27,30.48 9.65,30.48 v9.53,30.61 | VR1.3 22.88,30.48 21.72,30.48
+5V  (via drill 0.3, 0.41, 0.61)
  Top 0.406: IC3.4 26.24,30.26 C4.1 | 32.77,12.32 37.34,12.32 | J1.3 2.41,30.35 2.67,30.1 7.87,30.1 v8.64,29.34
  Top 0.508: J1.3 1.4,31.88 2.41,32.89 7.37,32.89 R2.2 | L2.2 19.56,4.32 v19.56,2.67 | v19.56,2.67 v17.4,2.67 | R11.2 20.49,1.1 19.81,1.78 19.81,2.41 v19.56,2.67
  Top 0.61: 31.5,31.37 SV2.2 33.91,32.77 37.97,32.77 38.1,32.64 38.61,32.64 39.24,32 39.24,13.46 38.1,12.32 37.34,12.32 | TP2.TP v17.4,2.67 C13.1 17.4,4.32 | 31.5,31.37 31.5,33.53 30.61,33.53 29.72,34.42 28.16,34.42 IC3.1 | 31.5,31.37 31.5,30.86 30.99,30.35 v30.99,28.45 | C4.1 26.16,29.72 v26.16,28.19 26.16,29.59 26.24,29.67 IC3.4 | L2.2 19.48,7.24 v19.43,7.37 | v28.96,12.95 32.13,12.95 32.77,12.32
  Bottom 0.508: v26.16,28.19 28.07,28.19 28.32,28.45 v30.99,28.45 | VR2.3 19.56,4.5 v19.56,2.67
  Bottom 0.61: v8.64,29.34 8.89,29.59 16.64,29.59 17.65,28.57 20.7,28.57 20.95,28.83 22.61,28.83 23.24,28.19 v26.16,28.19 26.16,30.51 VR1.1 | v19.43,7.37 19.56,7.49 19.56,8.76 20.19,9.4 24.51,9.4 28.07,12.95 v28.96,12.95
+12V  (via drill 0.41)
  Top 0.61: IC4.2 v23.24,6.73 | v26.16,9.53 24.76,9.53 24.38,9.91 C11.1 | SV2.1 37.97,31.37 38.35,30.99 38.35,17.4 v38.1,17.14 | R9.2 34.8,6.48 v35.31,6.98
  Bottom 0.61: JP1.2 32.26,1.65 32.77,2.16 32.77,6.98 | v38.1,17.14 38.1,7.37 37.72,6.98 v35.31,6.98 32.77,6.98 | VR2.1 22.91,4.7 23.24,4.7 v23.24,6.73 23.24,8.38 25.02,8.38 v26.16,9.53 26.92,10.29 30.86,10.29 32.26,8.76 32.26,8 32.77,7.49 32.77,6.98
AP0
  Top 0.254: U3.3 7.82,13.54 8.13,13.46 8.13,12.57 7.7,12.14 7.06,12.14 SV1.17
AP1
  Top 0.254: SV1.19 5.97,8.13 6.48,7.62 9.27,7.62 9.4,7.75 9.4,8.38 9.86,8.38 U4.3
AP2  (via drill 0.3)
  Top 0.254: SV1.18 3.94,11.05 v4.95,10.03 | v10.16,3.81 10.16,4.7 9.98,4.7 | U1.3 9.98,4.7 | 9.98,4.7 9.91,4.7
  Bottom 0.254: v4.95,10.03 4.7,9.78 4.7,7.87 5.59,6.98 6.73,6.98 7.11,6.6 7.11,5.21 7.87,4.45 9.53,4.45 v10.16,3.81
AP3
  Top 0.254: SV1.20 3.43,7.24 3.68,6.98 4.7,6.98 6.73,4.95 6.73,1.52 7.16,1.09 U2.3
AVDD
  Top 0.406: IC1.17 19.81,12.7 20.28,12.23 C2.2
  Top 0.61: L1.1 20.33,11.51 C2.2
CHA1  (via drill 0.3)
  Top 0.254: IC1.8 14.78,18.09 v15.88,19.18
  Bottom 0.254: v15.88,19.18 15.37,19.18 13.97,20.57 8.25,20.57 7.75,21.08 7.75,24.76 6.22,26.29 SV1.5
CHA2  (via drill 0.3)
  Top 0.254: IC1.42 17.41,24.27 17.27,24.13 15.37,24.13 14.48,25.02 v14.48,25.65
  Bottom 0.254: SV1.6 4.7,27.56 6.86,27.56 7.62,26.8 7.62,26.04 7.87,25.78 9.65,25.78 10.16,26.29 13.72,26.29 v14.48,25.65
CHB1  (via drill 0.3)
  Top 0.254: IC1.9 14.87,17.29 15.88,18.29 v16.76,18.29
  Bottom 0.254: SV1.7 6.73,23.75 7.24,23.24 7.24,20.83 8,20.07 13.72,20.07 15.37,18.41 16.64,18.41 v16.76,18.29
CHB2  (via drill 0.3)
  Top 0.254: IC1.41 18.21,26.36 v17.65,26.92 | SV1.8 4.7,25.02 8.25,25.02 8.76,25.53 8.76,26.42 v8.89,26.54
  Bottom 0.254: v17.65,26.92 17.65,26.54 17.27,26.16 16.38,26.16 14.86,27.56 9.02,27.56 8.89,27.43 v8.89,26.54
EN1  (via drill 0.3)
  Top 0.254: IC1.13 16.61,13.95 16.64,13.97 v16.64,15.24
  Bottom 0.254: v16.64,15.24 15.49,15.24 12.7,18.03 7.87,18.03 SV1.13
EN2  (via drill 0.3)
  Top 0.254: IC1.12 15.81,13.53 15.88,13.34 15.88,13.84 13.97,13.84 12.57,15.24 12.57,16.26 12.45,16.38 v11.68,16.38 | SV1.14 4.7,14.86 6.35,14.86 7.24,15.75 7.24,16.38 v8.25,16.38
  Bottom 0.254: v11.68,16.38 v8.25,16.38
GAIN_A1  (via drill 0.3)
  Top 0.254: J4.2 11.02,14.48 U3.4
  other vias: 9.65,14.48
GAIN_ANA2  (via drill 0.3)
  Top 0.254: J2.2 12.45,5.71 12.45,4.83 12.5,4.78 U1.4
  other vias: 11.43,5.71
GAIN_ANB2  (via drill 0.3)
  Top 0.254: J3.2 12.8,2.03 U2.4
  other vias: 11.43,2.03
GAIN_B1  (via drill 0.3)
  Top 0.254: J5.2 12.68,9.4 U4.4
  other vias: 11.3,9.4
GND  (via drill 0.3, 0.41, 0.81)
  Top 0.254: IC2.3 13.59,37.81 LED2.C
  Top 0.305: 10.29,5.71 v8.89,5.71 | 30.93,23.08 31.59,23.08 31.88,23.37 31.88,27.05 31.5,27.43 | 29.08,25.95 C7.1 | 27.18,24.51 27.18,24.64 | C17.2 14.19,8.55 | C18.2 14.82,4.87 | IC1.16 19.01,15.46 19.81,16.26 v19.81,18.16
  Top 0.406: IC2.3 v13.59,33.66 | IC2.1 v16.13,33.66 | IC2.4 12.32,33.91 v12.57,33.66 | LED1.C 7.08,37.75 7.11,37.72 LED1.C | LED1.C 7.11,37.59 | LED4.C 28.19,37.75 27.81,37.72 v27.81,38.99 | IC1.29 29.04,20.48 29.73,21.17 C3.2 | IC1.39 19.81,26.8 20.28,27.27 C5.1 20.32,28.23 v20.32,30.61 16.89,30.61 v16.13,31.37 14.86,31.37 IC2.7 | IC1.16 19.01,12.28 18.58,11.85 C2.1 17.65,11.56 17.65,7.11 17.53,6.98 C13.2 16,6.98 | C1.2 11.3,22.35 v10.29,23.37 | v10.29,23.37 v8.76,23.37 7.87,22.48 v4.7,22.48 v2.03,22.48 | v10.29,23.37 10.41,23.49 v10.41,32.13 v10.41,33.66 | IC1.6 12.83,19.68 12.57,19.94 12.57,20.32 12.19,20.7 C1.2 | 11.31,22.1 C1.2 | LED3.C 20.95,37.85 v20.95,38.99 | IC3.2 v27.18,33.15 | v27.18,33.15 C8.2 | v27.18,33.15 27.18,30.99 28,30.16 C4.2 29.63,29.72 R14.1 v29.59,27.43 | U3.2 v6.98,14.48 6.22,13.59 SV1.15 SV1.16 ICSP.3 | U1.2 10.29,5.71 10.41,5.71 | 31.5,27.43 v29.59,27.43 | v29.59,27.43 29.08,27.43 29.08,25.95 | C7.1 27.18,26.16 C6.2 27.18,24.64 27.18,24.58 XT1.2 | C18.2 14.9,4.83 16,4.83 | 16,4.83 v16,5.59 16,6.98 | 16,6.98 16,7.62 15.07,8.55 C17.2 14.22,8.13 13.59,7.49 11.56,7.49 v11.3,7.24 | 16,4.83 16,1.44 | 16,1.44 C16.2 | SV2.9 35.18,21.21 | 35.18,21.21 SV2.10 | SV2.4 35.18,28.83 35.18,21.21 | C10.2 8.38,20.32 8.76,20.7 C1.2 | 7.11,37.59 7.08,37.59 | C19.2 v8.89,12.45 | 10.41,9.4 U4.2 8.76,9.4 v8.64,9.53 | U2.2 8.89,2.03 v8.76,1.9 | XT1.4 30.48,23.08 C3.2 | v31.58,21.21 31.54,21.17 C3.2 | 16,1.44 v16.26,1.4 | v8.89,5.71 8.89,3.68 v9.02,3.68 | IC2.2 v14.86,33.66 | LP.C 7.21,36.2 v7.11,36.2 7.11,37.59
  Top 0.508: v28.07,33.15 v27.18,33.15
  Top 0.61: XT1.4 30.93,23.08 | IC4.PAD v27.3,4.83 | v27.3,4.83 27.3,4.19 IC4.4 | R10.2 v26.8,2.16 v26.8,3.05 27.3,3.05 v27.3,4.83 | C11.2 27.18,10.16 27.3,10.03 | 27.31,4.32 IC4.PAD | C11.2 27.18,11.68 R12.1 | C12.2 27.3,10.03 | 27.3,10.03 27.18,10.03 C11.2 | C8.2 24.83,31.62 C9.2 | IC3.2 27.18,35.31 27.81,35.94 27.81,37.63 LED4.C | 27.3,10.03 v27.3,9.27 v27.3,8.51 v27.3,7.24 IC4.PAD | H2.B2,8 31.24,3.43 JP1.1 | SV2.19 H2.B2,8 | v38.99,5.97 H2.B2,8 | v33.78,0.63 33.78,0.76 H2.B2,8
  Bottom 0.406: v16.13,31.37 v16.13,33.66 | v10.41,33.66 v12.57,33.66 v13.59,33.66 v14.86,33.66 v16.13,33.66 | v27.81,38.99 v20.95,38.99 20.57,38.61 20.57,36.45 19.43,35.31 19.43,34.04 19.05,33.66 v16.13,33.66 | v21.97,2.54 v21.08,2.54 21.21,2.67 VR2.2 21.21,5.59 | 21.21,5.97 VR2.4 20.85,6.99 | 7.87,33.66 7.87,36.2 v7.11,36.2 | H3.B2,8 v38.99,33.91 | v8.89,12.45 7.87,12.45 6.73,13.59 SV1.15 | 10.54,5.71 J2.3 v8.89,5.71 | J3.3 8.89,2.03 v8.76,1.9 9.02,2.16 v9.02,3.68 9.02,2.92 11.43,2.92 v11.43,3.17 | v8.89,5.71 8.89,9.27 v8.64,9.53 8.76,9.4 J5.3 | v8.89,5.71 8.89,7.24 v11.3,7.24
  Bottom 0.508: 7.87,32.89 7.87,33.66 v10.41,33.66 | H4.B2,8 6.86,36.45 v7.11,36.2
  Bottom 0.61: SV2.10 v31.58,21.21 | VR1.2 24.38,33.15 v26.29,33.15 | J6.3 1.27,32.89 7.87,32.89 J7.3 | v8.76,1.9 8.76,1.02 v5.84,1.02 H1.B2,8 1.02,5.84 v1.02,6.48 | v21.97,2.54 26.8,2.54 v26.8,3.05 v26.8,2.16 27.3,1.65 JP1.1 | 20.85,6.99 21.1,6.98 21.21,5.97 | 21.21,5.97 21.21,5.59 | 21.21,5.97 21.08,6.1 18.8,6.1 v18.29,5.59 v16,5.59
  other vias: 19.81,19.68 18.29,19.68 21.34,19.68 19.81,21.34 27.3,6.1 33.91,34.16 33.91,38.99 18.67,1.52 7.75,1.78 1.9,24.76 10.41,24.89 13.34,24.76 17.02,23.11 24.13,20.95 24,17.91 19.43,15.88 17.65,8.38 27.94,0.63 27.94,30.73
  pour Top (isolate 0.203): 0,39.88 0,0 39.88,0 39.88,39.88
  pour Bottom (isolate 0.203): 0,39.88 0,0 39.88,0 39.88,39.88
GP0  (via drill 0.3)
  Top 0.254: v22.99,24.13 22.99,25.46 IC1.35
  Bottom 0.254: SV2.12 32.51,18.67 31.88,19.3 30.86,19.3 29.72,20.45 29.72,22.22 26.54,25.4 24.64,25.4 24.26,25.02 22.99,25.02 v22.99,24.13
GP1
  Top 0.254: SV2.14 32.51,17.53 30.35,17.53 30.1,17.27 28.57,17.27 28.32,17.53 26.67,17.53 26.42,17.27 25.62,17.27 IC1.25
GP2  (via drill 0.3)
  Top 0.254: IC1.26 28.52,18.09 28.83,17.78 29.84,17.78 30.35,18.29 v31.62,18.29
  Bottom 0.254: SV2.16 33.78,13.59 31.62,15.75 v31.62,18.29
GP3  (via drill 0.3)
  Top 0.254: IC1.27 27.34,18.88 v27.3,18.92 28.57,18.92 28.96,18.54 v29.46,18.54
  Bottom 0.254: J4.4 9.7,13.46 21.08,13.46 22.35,14.73 22.35,15.62 22.86,16.13 26.16,16.13 27.3,17.27 v27.3,18.92 | SV2.18 31.62,13.34 31.62,14.1 30.35,15.37 29.97,15.37 29.46,15.88 v29.46,18.54
GP4  (via drill 0.3)
  Top 0.254: IC1.36 22.22,25.47 22.22,23.49 v22.99,22.73 | v26.16,14.61 v28.7,14.61
  Bottom 0.254: v22.99,22.73 22.99,22.61 26.92,22.61 28.07,21.46 28.07,17.91 28.32,17.65 28.32,14.99 v28.7,14.61 32.13,11.18 32.13,10.16 33.78,8.51 SV2.20 34.04,8.51 | J5.4 12.88,8.43 13.21,8.76 13.21,11.94 22.35,11.94 22.73,11.56 23.24,11.56 23.88,12.19 23.88,13.21 25.27,14.61 v26.16,14.61
GP5  (via drill 0.3)
  Top 0.254: IC1.34 23.81,23.62 v23.75,23.49 | v30.73,13.84 v27.94,13.84
  Bottom 0.254: SV2.17 35.18,9.78 33.4,9.78 32.64,10.54 32.64,11.56 30.73,13.46 v30.73,13.84 28.83,15.75 28.83,18.03 28.57,18.29 28.57,21.72 27.18,23.11 25.4,23.11 25.02,23.49 v23.75,23.49 | J3.4 14.78,1.07 15.24,1.52 15.24,7.37 15.88,8 15.88,9.14 16.76,10.03 24.13,10.03 v27.94,13.84
GP6  (via drill 0.3)
  Top 0.254: IC1.33 25.61,23.71 25.44,23.71 25.4,23.75 25.78,23.75 v25.78,24.51 | v30.73,16.13 v27.43,16.13
  Bottom 0.254: v25.78,24.51 26.67,24.51 29.08,22.1 29.08,20.32 30.48,18.92 30.48,16.38 v30.73,16.13 30.73,15.88 32.26,14.22 32.26,13.46 33.4,12.32 35.18,12.32 SV2.15 | J2.4 13.39,4.75 14.22,5.59 14.22,7.87 14.86,8.51 14.86,9.65 16.26,11.05 23.49,11.05 24.38,11.94 24.38,12.83 25.4,13.84 26.67,13.84 27.43,14.61 v27.43,16.13
GP7  (via drill 0.3)
  Top 0.254: IC1.43 16.61,26.64 v16.64,26.92
  Bottom 0.254: v16.64,26.92 15.49,28.07 7.37,28.07 7.37,29.59 6.86,30.1 1.6,30.1 J6.1
GP8  (via drill 0.3)
  Top 0.254: IC1.32 24.74,22.88 24.51,23.11 24.51,27.18 23.88,27.81 v21.72,27.81
  Bottom 0.254: v21.72,27.81 16.64,27.81 15.88,28.57 7.87,28.57 J7.1
LD1
  Top 0.254: IC1.2 12.68,22.88 11.94,23.62 11.68,23.88 11.68,36.83 12.45,37.59 R4.1
LD2  (via drill 0.3)
  Top 0.254: IC1.3 12.71,22.08 11.18,23.62 11.18,35.69 v10.79,35.69 | v19.3,36.58 19.3,37.85 R5.1
  Bottom 0.254: v10.79,35.69 18.8,35.69 19.3,36.2 v19.3,36.58
LD3  (via drill 0.3)
  Top 0.254: IC1.4 15.19,21.29 v15.37,21.46 | v26.42,35.94 26.42,37.81 R6.1
  Bottom 0.254: v15.37,21.46 15.49,21.59 15.49,24.76 15.88,25.15 18.8,25.15 19.05,25.4 20.19,25.4 20.32,25.53 20.32,26.29 21.08,27.05 22.1,27.05 23.11,27.05 23.49,27.43 27.56,27.43 27.94,27.05 28.96,26.04 31.11,26.04 32,26.92 32,28.57 30.61,29.97 30.61,33.66 29.34,34.92 27.69,34.92 26.67,35.94 v26.42,35.94
LD4  (via drill 0.3)
  Top 0.254: IC1.5 15.79,20.48 v16.13,20.83 | v30.86,34.54 31.62,34.54 31.96,34.89 31.96,36.03 R8.1
  Bottom 0.254: v16.13,20.83 16.13,24.51 16.26,24.64 18.03,24.64 18.92,24.64 19.18,24.64 19.43,24.89 19.81,24.89 20.57,24.89 20.83,25.15 20.83,25.91 21.46,26.54 23.37,26.54 23.75,26.92 27.18,26.92 27.3,26.92 27.69,26.54 28.7,25.53 31.5,25.53 32.51,26.54 32.51,28.96 31.11,30.35 31.11,34.16 30.86,34.42 v30.86,34.54
MCLR  (via drill 0.3)
  Top 0.254: IC1.18 20.61,15.24 v20.57,15.24
  Top 0.305: IC1.18 20.61,12.92 20.83,12.7 21.21,12.7 22.26,11.64 R1.1
  Bottom 0.254: v20.57,15.24 20.57,14.73 20.32,14.48 15.49,14.48 12.7,17.27 7.87,17.27 7.37,16.76 7.37,15.88 6.35,14.86 2.67,14.86 2.16,15.37 2.16,17.4 ICSP.1
MCU_AP0  (via drill 0.3)
  Top 0.254: IC1.19 21.41,15.24 v21.59,15.24 | U3.1 9.45,15.42 v9.65,15.62
  Bottom 0.254: v9.65,15.62 13.59,15.62 15.24,13.97 20.57,13.97 21.59,14.99 v21.59,15.24
MCU_AP1  (via drill 0.3)
  Top 0.254: IC1.20 22.21,14.72 22.73,15.24 v23.24,15.24 | U4.1 9.02,10.34 v9.02,11.3
  Bottom 0.254: v9.02,11.3 9.65,11.3 11.3,12.95 21.34,12.95 22.86,14.35 22.86,14.86 v23.24,15.24
MCU_AP2/PGD  (via drill 0.3)
  Top 0.254: IC1.21 v23.01,12.47 | R15.1 8.04,8.47 8,8.51 7.75,8.51 7.49,8.76 v7.49,9.78
  Bottom 0.254: v7.49,9.78 7.49,10.41 | ICSP.4 2.41,12.32 6.86,12.32 7.49,11.68 7.49,10.41 | v23.01,12.47 22.99,12.45 11.68,12.45 9.65,10.41 7.49,10.41
MCU_AP3/PGC  (via drill 0.3)
  Top 0.254: IC1.22 23.81,13.27 24,13.08 v25.65,13.08 | ICSP.5 2.41,9.78 4.19,9.78 4.7,9.27 4.7,7.75 5.46,6.98 6.48,6.98 6.6,6.86 6.6,6.1 7.11,5.59 v7.87,5.59 R16.1
  Bottom 0.254: v25.65,13.08 25.65,12.32 23.88,10.54 16.51,10.54 15.37,9.4 15.37,8.25 14.73,7.62 14.73,4.83 14.1,4.19 12.19,4.19 11.94,3.94 11.05,3.94 10.03,4.95 8.51,4.95 v7.87,5.59
N$1
  Top 0.406: IC3.3 26.24,34.98 25.53,35.69 L3.1
N$2
  Top 0.254: IC1.30 28.86,21.29 29.65,22.08 29.65,23.68 30.1,24.13 30.35,24.13 30.48,24.26 30.47,24.58 | 30.47,24.58 XT1.1 | 30.47,24.58 30.47,26.07 C7.2
N$3
  Top 0.254: IC1.31 28.31,22.08 28.62,22.39 XT1.3
  Top 0.305: XT1.3 27.48,23.08 C6.1
N$4
  Top 0.61: IC4.1 C14.1
N$5
  Top 0.254: R2.1 9.14,33.27 9.14,35.27 LP.A
N$6
  Top 0.406: IC4.7 31.88,6.73 32.13,6.48 R9.1
N$7  (via drill 0.3)
  Top 0.254: R13.1 24.73,29.08 v24.64,29.08 | v29.59,32.51 29.59,31.37
  Top 0.406: IC3.5 28.59,31.37 29.59,31.37 R14.2
  Bottom 0.254: v24.64,29.08 25.02,29.08 25.15,29.21 25.15,31.62 25.27,31.75 26.42,31.75 26.92,31.24 26.92,29.21 28.32,29.21 29.84,29.21 30.1,29.46 30.1,32.51 v29.59,32.51
N$8
  Top 0.406: IC4.8 30.48,8 30.48,10.03 C12.1
N$9
  Top 0.254: 29.21,4.19 IC4.5 29.84,3.17 28.57,3.17 27.81,2.41 27.81,1.65 27.43,1.27 23.79,1.27 | R11.1 23.79,1.27 | R10.1 23.79,1.27
N$10
  Bottom 0.406: J6.2 SV1.2
N$12
  Top 0.406: LED1.A R4.2
N$13
  Top 0.406: LED2.A R5.2
N$15
  Top 0.406: C14.2 21.5,6.82 21.72,6.6 22.86,5.46
  Top 0.61: IC4.3 22.86,5.46 22.86,4.45 22.73,4.32 L2.1
N$16  (via drill 0.3)
  Top 0.254: C15.1 31.88,8 v31.37,7.49 | v31.37,5.46 IC4.6
  Bottom 0.254: v31.37,7.49 v31.37,5.46
N$17
  Top 0.254: R12.2 31.75,11.68 31.88,11.56 C15.2
N$21
  Top 0.254: U1.1 8.37,6.65 R15.2
N$22
  Top 0.254: U2.1 8.27,2.97 R16.2
N$23
  Bottom 0.406: SV1.1 J7.2
PWMA1  (via drill 0.3)
  Top 0.254: SV1.9 8.13,21.21 8.89,21.97 v9.27,21.97 | IC1.14 17.41,15.89 18.16,16.64 v18.16,18.67
  Bottom 0.254: v9.27,21.97 9.27,21.34 9.53,21.08 14.22,21.08 15.37,19.94 16.51,19.94 17.78,18.67 v18.16,18.67
PWMA2  (via drill 0.3)
  Top 0.254: IC1.10 14.96,16.48 15.75,17.27 v17.14,17.27
  Bottom 0.254: v17.14,17.27 16.76,17.27 16.13,17.91 15.11,17.91 13.46,19.56 7.75,19.56 7.37,19.94 4.7,19.94 SV1.10
PWMB1  (via drill 0.3)
  Top 0.254: IC1.15 18.21,15.32 v18.16,15.37
  Bottom 0.254: SV1.11 6.98,18.67 7.37,19.05 13.21,19.05 14.86,17.4 15.88,17.4 17.27,16.13 18.03,16.13 18.16,16 v18.16,15.37
PWMB2  (via drill 0.3)
  Top 0.254: 14.16,15.69 IC1.11 15.69,15.69 v16.13,16.13
  Bottom 0.254: v16.13,16.13 15.62,16.64 14.86,16.64 12.95,18.54 7.62,18.54 6.48,17.4 4.7,17.4 SV1.12
RX1  (via drill 0.3)
  Top 0.254: v20.32,23.88 20.57,24.26 20.57,25.45 IC1.38
  Bottom 0.254: v20.32,23.88 20.95,23.24 21.84,23.24 22.22,23.62 22.22,25.27 22.48,25.53 24,25.53 24.38,25.91 26.8,25.91 30.23,22.48 35.05,22.48 36.32,23.75 SV2.7
RX2  (via drill 0.3)
  Top 0.254: IC1.24 25.61,16.51 26.54,16.51 27.05,17.02 28.07,17.02 28.32,16.76 30.35,16.76 30.61,17.02 31.88,17.02 v32.38,16.51
  Bottom 0.254: v32.38,16.51 33.27,17.4 35.18,17.4 SV2.11
SCL  (via drill 0.3)
  Top 0.254: IC1.44 15.81,26.86 15.49,27.18 13.97,27.18 13.59,27.56 IC2.6 13.59,31.75 13.97,32.13 16.51,32.13 17.4,31.24 18.67,31.24 19.18,31.75 v19.18,32.26 R3.2
  Bottom 0.254: SV2.8 35.18,25.02 37.72,25.02 38.35,25.65 38.35,32.26 37.34,33.27 33.27,33.27 33.02,33.53 33.02,36.2 32.51,36.7 28.57,36.7 27.3,37.97 22.22,37.97 21.46,37.21 21.46,36.2 20.45,35.18 20.45,32.89 19.81,32.26 v19.18,32.26
SDA  (via drill 0.3)
  Top 0.254: 17.53,32.64 13.21,32.64 12.32,31.75 IC2.5 12.32,24.26 12.89,23.68 IC1.1 | v17.53,32.26 17.53,32.64 | 17.53,32.64 R7.2
  Bottom 0.254: SV2.6 35.18,27.56 36.96,27.56 37.72,28.32 37.72,32 36.96,32.77 33.02,32.77 32.51,33.27 32.51,35.94 32.26,36.2 28.32,36.2 27.05,37.47 22.61,37.47 21.97,36.83 21.97,35.94 20.95,34.92 20.95,32.64 19.68,31.37 18.03,31.37 17.53,31.88 v17.53,32.26
TX1  (via drill 0.3)
  Top 0.254: 21.41,25.48 IC1.37 21.29,25.02 21.34,25.02 v21.34,24
  Bottom 0.254: v21.34,24 21.34,25.53 | 21.34,25.53 21.84,26.04 | 21.84,26.04 21.34,25.53 | 21.34,25.53 21.84,26.04 | 21.84,26.04 22.22,26.04 23.62,26.04 24,26.42 27.05,26.42 27.43,26.04 28.45,25.02 34.42,25.02 35.69,26.29 SV2.5
TX2
  Top 0.254: IC1.23 26.73,15.69 27.05,15.37 32.77,15.37 33.27,14.86 35.18,14.86 SV2.13
VCAP/VDDCORE
  Top 0.406: IC1.7 12.92,18.88 12.7,18.67 12.7,18.16 12.45,17.91 C1.1
VENC
  Top 0.406: J1.2 SV1.4
  Bottom 0.406: SV1.4 SV1.3
VENC1-LD3
  Top 0.406: R6.2 LED3.A
VENC2-LD4
  Top 0.254: 30.35,37.75 LED4.A
  Top 0.508: R8.2 32,37.72 LED4.A

### Text on the board
tPlace: 4 | 5.0 | 2 | 1 | 1 | 12V | 3v | VENC | 5 | 8 | 34 | CHA | 3.3 | TX1 | CHB | 1 | RX1 | 1 | GND | RX2 | 23 | TX2 | IO6 | IO5 | 19 | GND | 19
bPlace: MOT2 | MOT1 | GND | 5 | VBAT | IO8 | IO7 | GAIN / CONFIG / OPEN : 1 / 2-1 : 50 / 2-3 : 10 / 2-4 : I/O | VENC | G | 3 | CH_A | SDA | TX1 | CH_B | SCL | RX1 | PWMA | G | MCL | PWMB | uNav44 / Rel1.0 | RX2 | EN | 1 2 3 | IO1 | TX2 | 4 | IO2 | IO6 | ANA | OFFICINEROBOTICHE.IT | IO3 | IO5 | ANB | IO4 | G | PGC | - | +
tNames: +
_tsilk: LED1 | R4 | LED2 | R5 | LED3 | R6 | LED4 | R8 | LP | R7 | R3 | 4 | L3 | C8 | SV1 | IC2 | IC3 | SV2 | 5.0 | R2 | C9 | 2 | 1 | 1 | R13 | 12V | C5 | R14 | 3v | VENC | 5 | 8 | 34 | C4 | C7 | CHA | 3.3 | IC1 | XT1 | TX1 | J1 | CHB | 1 | C1 | RX1 | C6 | 1 | C3 | GND | C10 | RX2 | * | 23 | U3 | TX2 | R12 | C19 | C11 | C12 | IO6 | C17 | C2 | C15 | * | U4 | R1 | IO5 | C13 | L1 | IC4 | * | C18 | C14 | 19 | GND | 19 | L2 | U1 | R15 | R9 | * | C16 | + | R16 | U2 | R11 | R10 | JP1
_bsilk: MOT2 | MOT1 | VR1 | GND | J7 | 5 | VBAT | IO8 | IO7 | J6 | GAIN / CONFIG / OPEN : 1 / 2-1 : 50 / 2-3 : 10 / 2-4 : I/O | VENC | G | 3 | CH_A | SDA | TX1 | CH_B | SCL | RX1 | PWMA | G | MCL | PWMB | uNav44 / Rel1.0 | RX2 | EN | 1 2 3 | IO1 | TX2 | J4 | 4 | IO2 | IO6 | ANA | OFFICINEROBOTICHE.IT | IO3 | IO5 | J5 | VR2 | ANB | IO4 | G | PGC | J2 | J3 | - | +